# EAGLE design class-d-amp (EAGLE 5.10)
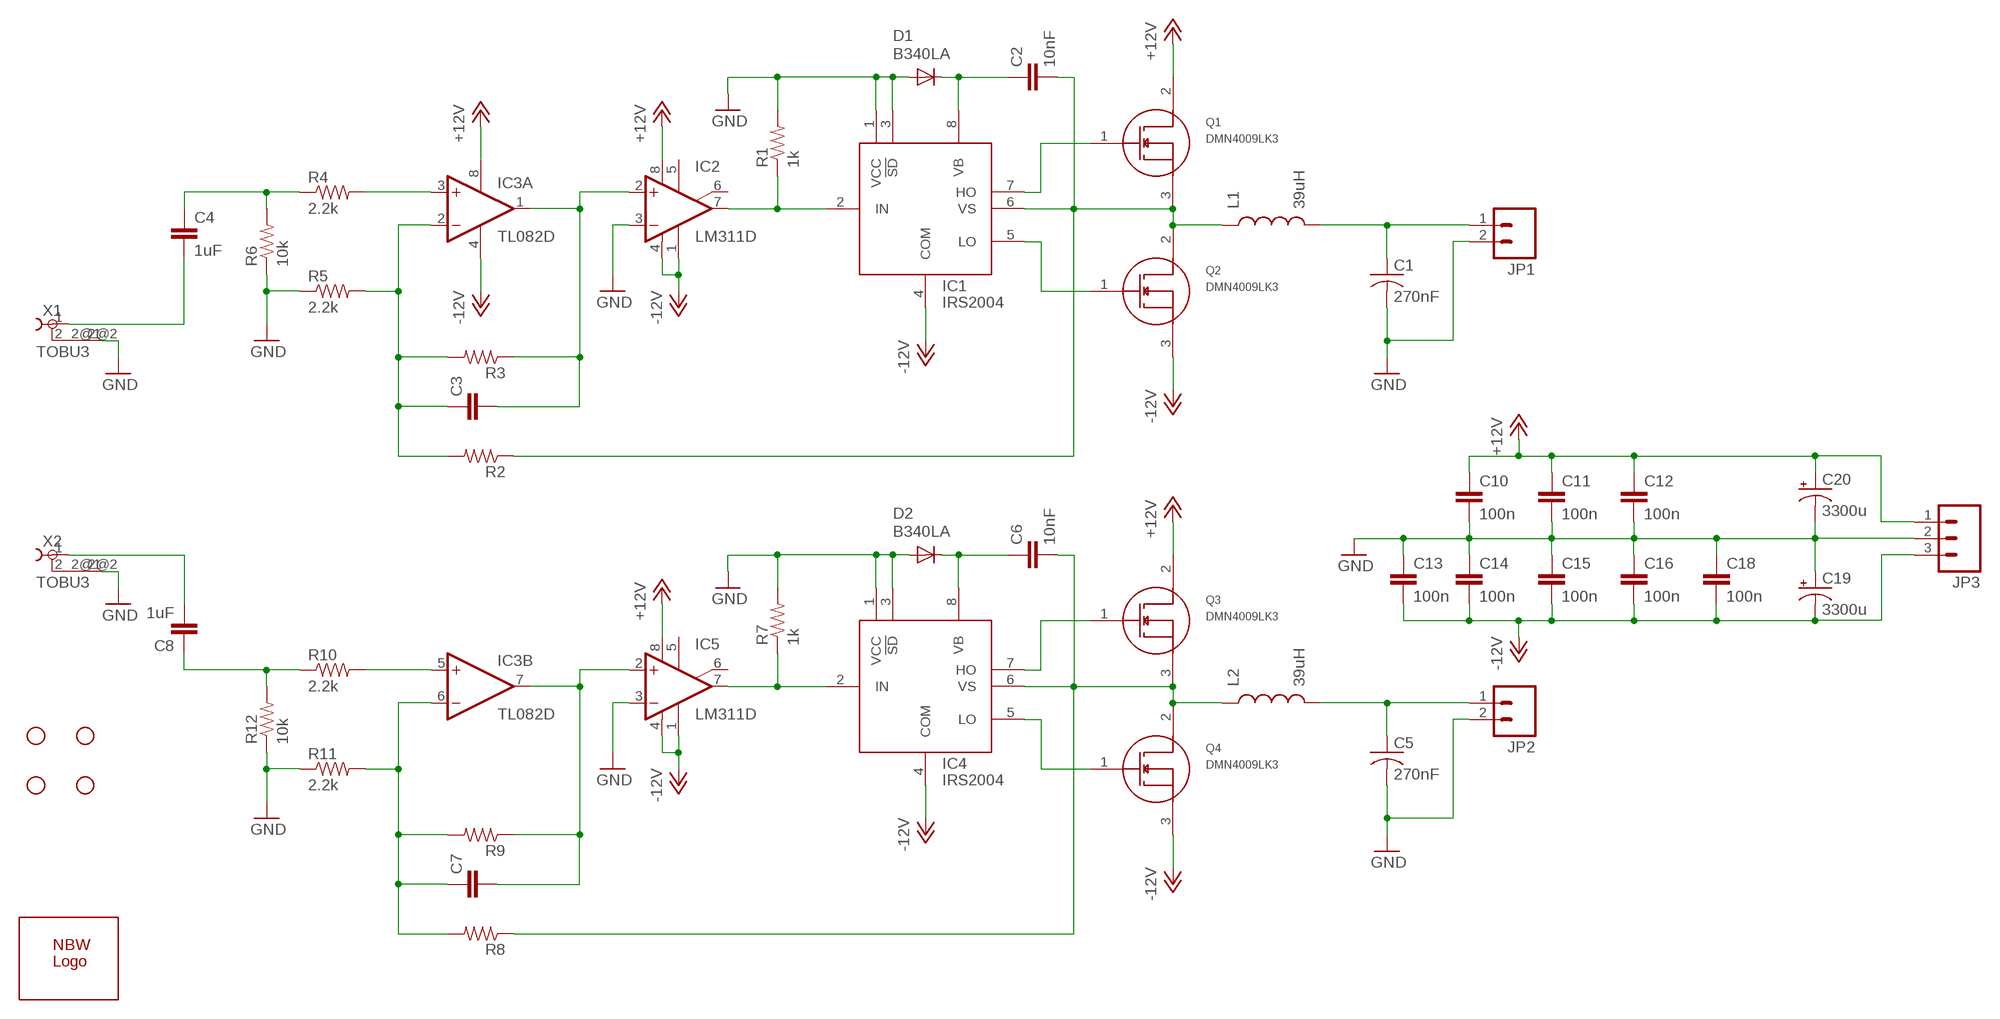
[diagram p0: schematic, sheet 1]

## Parts
C1  270nF  C-USC1210  [C1210]
C2  10nF  CAP0603  [0603]
C3  CAP0603  [0603]
C4  1uF  CAP0603  [0603]
C5  270nF  C-USC1210  [C1210]
C6  10nF  CAP0603  [0603]
C7  CAP0603  [0603]
C8  1uF  CAP0603  [0603]
C10  100n  CAP0603  [0603]
C11  100n  CAP0603  [0603]
C12  100n  CAP0603  [0603]
C13  100n  CAP0603  [0603]
C14  100n  CAP0603  [0603]
C15  100n  CAP0603  [0603]
C16  100n  CAP0603  [0603]
C18  100n  CAP0603  [0603]
C19  3300u  CPOL-USE7.5-16  [E7,5-16]
C20  3300u  CPOL-USE7.5-16  [E7,5-16]
D1  B340LA  DIODESMA  [SMA-DIODE]
D2  B340LA  DIODESMA  [SMA-DIODE]
IC1  IRS2004  IR2302  [SO-08]
IC2  LM311D  [SO08]
IC3  TL082D  [SO08]
IC4  IRS2004  IR2302  [SO-08]
IC5  LM311D  [SO08]
JP1  M02PTH  [1X02]
JP2  M02PTH  [1X02]
JP3  M03PTH  [1X03]
L1  39uH  INDUCTORPWR  [CDRH125]
L2  39uH  INDUCTORPWR  [CDRH125]
Q1  DMN4009LK3  [TO252-3L]
Q2  DMN4009LK3  [TO252-3L]
Q3  DMN4009LK3  [TO252-3L]
Q4  DMN4009LK3  [TO252-3L]
R1  1k  RESISTOR0603  [0603]
R2  RESISTOR0603  [0603]
R3  RESISTOR0603  [0603]
R4  2.2k  RESISTOR0603  [0603]
R5  2.2k  RESISTOR0603  [0603]
R6  10k  RESISTOR0603  [0603]
R7  1k  RESISTOR0603  [0603]
R8  RESISTOR0603  [0603]
R9  RESISTOR0603  [0603]
R10  2.2k  RESISTOR0603  [0603]
R11  2.2k  RESISTOR0603  [0603]
R12  10k  RESISTOR0603  [0603]
U$1  STAND-OFF  [STAND-OFF]
U$2  STAND-OFF  [STAND-OFF]
U$3  STAND-OFF  [STAND-OFF]
U$4  STAND-OFF  [STAND-OFF]
U$5  NBW_LOGOSMALL  [NBW_LOGO]
X1  TOBU3  [TOBU3]
X2  TOBU3  [TOBU3]

## Nets
+12V: C10.1 C11.1 C12.1 C20.+ IC2.8(V+) IC3.8(P:V+) IC5.8(V+) JP3.1 Q1.2 Q3.2
GND: C1.2 C5.2 C10.2 C11.2 C12.2 C13.1 C14.1 C15.1 C16.1 C18.1 C19.+ C20.- D1.A D2.A IC1.1(VCC) IC1.3(!SD) IC2.3(-IN) IC4.1(VCC) IC4.3(!SD) IC5.3(-IN) JP1.2 JP2.2 JP3.2 R1.2 R5.1 R6.1 R7.2 R11.1 R12.1 X1.2@2 X2.2@2
N$1: C1.1 JP1.1 L1.2
N$2: C3.2 IC2.2(+IN) IC3.1(A:OUT) R3.1
N$3: IC3.3(A:+IN) R4.2
N$4: IC1.7(HO) Q1.1
N$5: IC1.5(LO) Q2.1
N$6: IC1.2(IN) IC2.7(OUT) R1.1
N$7: C2.1 D1.C IC1.8(VB)
N$8: C3.1 IC3.2(A:-IN) R2.2 R3.2 R5.2
N$9: C2.2 IC1.6(VS) L1.1 Q1.3 Q2.2 R2.1
N$10: C4.1 R4.1 R6.2
N$11: C5.1 JP2.1 L2.2
N$12: IC4.7(HO) Q3.1
N$13: IC4.5(LO) Q4.1
N$14: C7.2 IC3.7(B:OUT) IC5.2(+IN) R9.1
N$15: IC4.2(IN) IC5.7(OUT) R7.1
N$16: C6.1 D2.C IC4.8(VB)
N$17: C7.1 IC3.6(B:-IN) R8.2 R9.2 R11.2
N$18: C6.2 IC4.6(VS) L2.1 Q3.3 Q4.2 R8.1
N$19: IC3.5(B:+IN) R10.2
N$20: C8.1 R10.1 R12.2
N$21: C4.2 X1.1
N$22: C8.2 X2.1
N$24: C13.2 C14.2 C15.2 C16.2 C18.2 C19.- IC1.4(COM) IC2.1(GND) IC2.4(V-) IC3.4(P:V-) IC4.4(COM) IC5.1(GND) IC5.4(V-) JP3.3 Q2.3 Q4.3 ; supply symbol labelled -12V
Unconnected: IC2.5(ON) IC2.6(ON/STR) IC5.5(ON) IC5.6(ON/STR) X1.2 X1.2@1 X2.2 X2.2@1

## Library data of the parts
C1 C5 = rcl:C-US: CAPACITOR, American symbol
C2-C4 C6-C8 C10-C16 C18 = SparkFun:CAP: Capacitor Standard 0603 ceramic capacitor, and 0.1" leaded capacitor.
C19 C20 = rcl:CPOL-US: POLARIZED CAPACITOR, American symbol
D1 D2 = SparkFun:DIODE: Diode These are standard reverse protection diodes and small signal diodes. SMA package can handle up to about 1A. SOD-323 can handle about 200mA. What the SOD-323 package when ordering, there are some mfgs out there that are 5-pin packages.
IC1 IC4 = Custom:IR2302
IC2 IC5 = linear:LM311: COMPARATOR
IC3 = linear:TL082: OP AMP
JP1 JP2 = SparkFun:M02: Header 2 Standard 2-pin 0.1" header. Use with straight break away headers (SKU : PRT-00116), right angle break away headers (PRT-00553), swiss pins (PRT-00743), machine pins (PRT-00117), and female headers (PRT-00115). Molex polarized connector foot print use with SKU : PRT-08233 with associated crimp pins and housings.
JP3 = SparkFun:M03: Header 3 Standard 3-pin 0.1" header. Use with straight break away headers (SKU : PRT-00116), right angle break away headers (PRT-00553), swiss pins (PRT-00743), machine pins (PRT-00117), and female headers (PRT-00115). Molex polarized connector foot print use with SKU : PRT-08232 with associated crimp pins and housings.
L1 L2 = SparkFun:INDUCTOR: Inductors Basic Inductor/Choke - 0603 and 1206. Footprints are not proven and vary greatly between part numbers.
Q1-Q4 = Custom:DMN4009LK3
R1-R12 = SparkFun:RESISTOR: Resistor Basic schematic elements and footprints for 0603, 1206, and PTH 1/10th watt (small) resistors.
U$1-U$4 = SparkFun:STAND-OFF: Stand Off This is the mechanical footprint for a #4 phillips button head screw. Use the keepout ring to avoid running the screw head into surrounding components. SKU : PRT-00447
U$5 = NBitWonder:NBW_LOGO
X1 X2 = con-hirschmann:TOBU3: Female Cinch CONNECTOR ( RCA Jack )

## Board
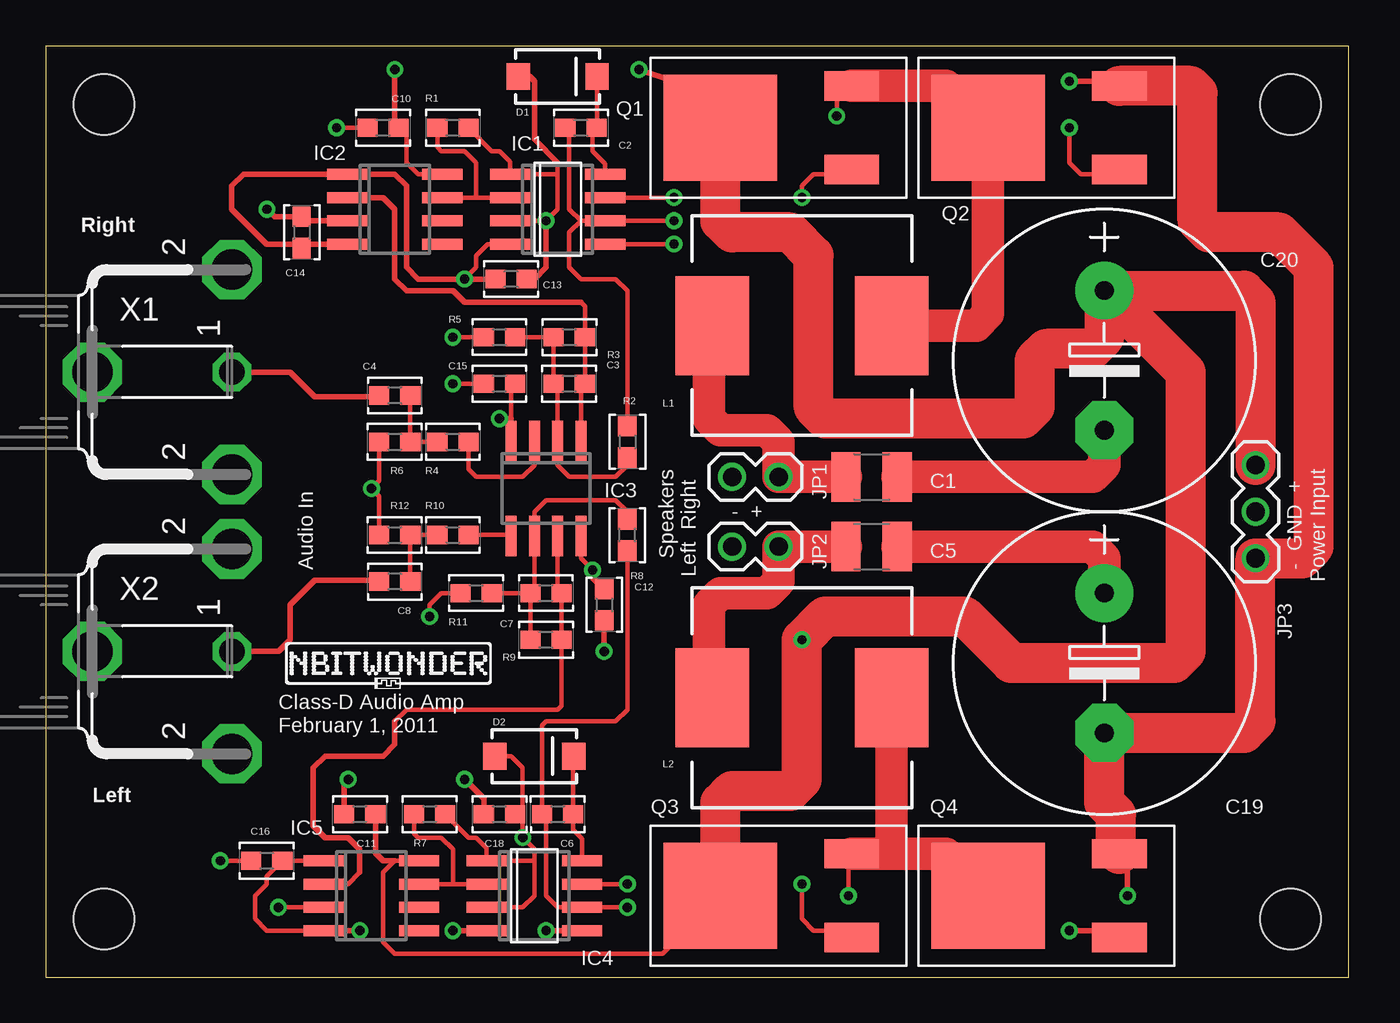
[diagram p1: board, top side]
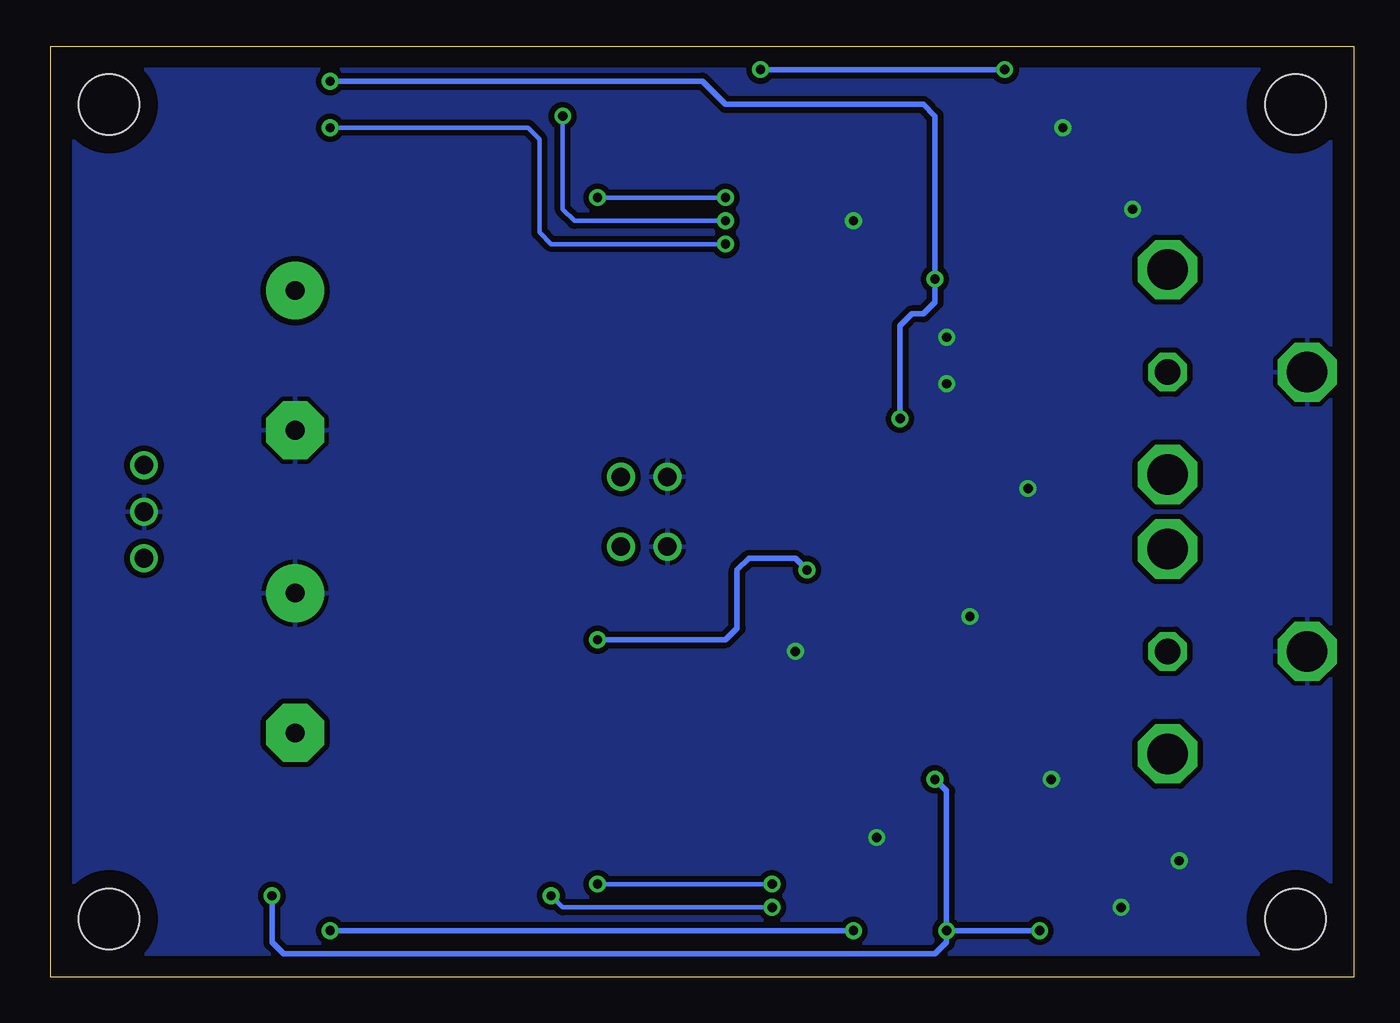
[diagram p2: board, bottom side, seen from below]

Size 71.12 x 50.8 mm. Coordinates in mm from the lower left corner, seen from the top.
Outline: 0,0 71.12,0 71.12,50.8 0,50.8 0,0
Copper layers (1*16): Top 0.035mm / dielectric 1.5mm / Bottom 0.035mm
Design rules "default *": minimum track width 10mil, minimum drill 24mil, track to track 8mil, track to pad 8mil, pad to pad 8mil, via to via 8mil, smd to smd 8mil, copper to edge 40mil, drill to drill 8mil, minimum pad ring 10mil, minimum via ring 8mil, stop-mask expansion 4mil, vias tented up to drill 20mil, thermal gap 10mil

### Footprints (pad centres in the part's own frame; a part is rotated, then mirrored left to right if it is on the bottom)
C1210 = smd 1.6 x 2.7: 1 -1.4,0; 2 1.4,0
0603 = smd 1.1 x 1: 1 -0.85,0; 2 0.85,0
E7,5-16 = drill 1.016 pad 3.15 round: + -3.81,0 | drill 1.016 pad 3.15 octagon: - 3.81,0
SMA-DIODE = smd 1.27 x 1.47: A -2.15,0; C 2.15,0
SO-08 = smd 0.6 x 2.2: 1 -1.905,-2.6; 2 -0.635,-2.6; 3 0.635,-2.6; 4 1.905,-2.6; 5 1.905,2.6; 6 0.635,2.6; 7 -0.635,2.6; 8 -1.905,2.6
SO08 = smd 0.6 x 2.2: 1 -1.905,-2.6; 2 -0.635,-2.6; 3 0.635,-2.6; 4 1.905,-2.6; 5 1.905,2.6; 6 0.635,2.6; 7 -0.635,2.6; 8 -1.905,2.6
1X02 = drill 1.016 round: 1 0,0; 2 2.54,0
1X03 = drill 1.016 round: 1 0,0; 2 2.54,0; 3 5.08,0
CDRH125 = smd 5.4 x 4: 1 0,4.9; 2 0,-4.9
TO252-3L = smd 2.997 x 1.6: 1 7.163,-2.286; 3 7.163,2.286 | smd 6.198 x 5.791: 2 0,0
STAND-OFF = hole 3.302: 0,0
TOBU3 = drill 1.397 octagon: 1 0,-2.54 | drill 2.21 octagon: 2 5.588,-2.54; 2@1 -5.588,-2.54; 2@2 0,5.08

### Placement (x,y rotation side)
C1  45.09,27.3 0 top
C2  29.21,46.35 180 top
C3  28.57,32.38 0 top
C4  19.05,31.75 180 top
C5  45.09,23.5 0 top
C6  27.94,8.89 180 top
C7  27.3,20.95 0 top
C8  19.05,21.59 180 top
C10  18.41,46.35 180 top
C11  17.14,8.89 180 top
C12  30.48,20.32 270 top
C13  25.4,38.1 180 top
C14  13.97,40.64 270 top
C15  24.77,32.38 0 top
C16  12.06,6.35 0 top
C18  24.77,8.89 180 top
C19  57.78,17.14 270 top
C20  57.78,33.66 270 top
D1  27.94,49.15 0 top
D2  26.67,12.06 0 top
IC1  27.94,41.91 270 top
IC2  19.05,41.91 270 top
IC3  27.3,26.67 180 top
IC4  26.67,4.45 270 top
IC5  17.78,4.45 270 top
JP1  40.01,27.3 180 top
JP2  40.01,23.5 180 top
JP3  66.04,27.94 270 top
L1  41.27,35.56 270 top
L2  41.27,15.24 270 top
Q1  36.83,46.35 0 top
Q2  51.44,46.35 0 top
Q3  36.83,4.45 0 top
Q4  51.44,4.45 0 top
R1  22.23,46.35 0 top
R2  31.75,29.21 270 top
R3  28.57,34.92 180 top
R4  22.23,29.21 0 top
R5  24.77,34.92 0 top
R6  19.05,29.21 0 top
R7  20.95,8.89 0 top
R8  31.75,24.13 90 top
R9  27.3,18.41 180 top
R10  22.23,24.13 0 top
R11  23.5,20.95 0 top
R12  19.05,24.13 0 top
U$1  3.17,3.17 0 top
U$2  3.17,47.62 0 top
U$3  67.94,3.17 0 top
U$4  67.94,47.62 0 top
U$5  12.7,15.24 0 top
X1  7.62,33.02 90 top
X2  7.62,17.78 90 top

### Tracks (layer width: path | path; a pad name or v marks a point on that pad's centre or on a via)
+12V  (via drill 0.51)
  Top 0.254: IC5.8 19.05,6.35 18.41,5.71 18.41,1.91 19.05,1.27 33.66,1.27 Q3.2 | IC2.8 20.32,43.81 19.68,44.45 19.68,45.94 C10.1 | IC3.8 29.21,22.86 v29.84,22.23
  Top 0.305: Q1.2 34.29,48.9 v32.38,49.53 | v19.05,49.53 19.05,46.57 C10.1 | C11.1 18,6.77 18.41,6.35 19.05,6.35 | v29.84,22.23 29.84,21.8 C12.1
  Top 2.184: JP3.1 66.04,36.83 65.41,37.47 C20.+ | C20.+ 57.78,34.92 57.15,34.29 54.61,34.29 53.98,33.66 53.98,31.11 53.34,30.48 42.55,30.48 41.91,31.11 41.91,39.37 40.64,40.64 37.47,40.64 36.83,41.27 Q1.2 | Q3.2 36.83,9.53 37.47,10.16 40.64,10.16 41.27,10.79 v41.27,18.41 42.55,19.68 50.16,19.68 52.7,17.14 61.59,17.14 62.23,17.78 62.23,33.02 C20.+
  Bottom 0.305: v32.38,49.53 v19.05,49.53 | v41.27,18.41 34.29,18.41 33.66,19.05 33.66,22.23 33.02,22.86 30.48,22.86 v29.84,22.23
GND  (via drill 0.51)
  Top 0.254: IC4.3 26.04,3.81 26.67,4.45 26.67,6.35 | 26.67,6.35 26.67,6.99 v26.04,7.62 26.04,8.47 C18.1 26.04,9.31 26.04,11.43 25.4,12.06 D2.A | 26.67,6.35 IC4.1 24.07,7.04 23.5,7.62 23.07,7.62 R7.2 | IC1.3 v27.3,41.27 27.94,41.91 27.94,43.81 | 27.94,43.81 27.94,44.45 | 27.94,43.81 IC1.1 25.34,44.51 24.77,45.09 24.34,45.09 R1.2 | R6.1 18.2,27.09 v17.78,26.67 18.2,26.25 R12.1 | IC5.3 v12.7,3.81 | R11.1 21.59,20.95 20.95,20.32 v20.95,19.68 | C10.2 v15.88,46.35 | v22.23,34.92 R5.1 | v22.23,32.38 C15.1 | v9.53,6.35 C16.1
  Top 0.305: C12.2 v30.48,17.78 | C11.2 16.3,10.58 v16.51,10.79 | D1.A 26.41,49.15 26.67,48.9 26.67,45.72 27.94,44.45 | C13.1 26.67,38.1 27.3,38.73 v27.3,41.27 | IC2.3 14.19,41.27 C14.1 12.48,41.49 v12.06,41.91
  Top 1.778: C1.2 57.15,27.3 57.78,27.94 C20.- | C5.2 57.15,23.5 57.78,22.86 C19.+
  pour Bottom (isolate 0.305): 1.27,1.27 69.85,1.27 69.85,49.53 1.27,49.53
N$1
  Top 1.778: L1.2 36.2,35.38 36.2,30.48 36.83,29.84 39.37,29.84 40.01,29.21 JP1.1 C1.1
N$2
  Top 0.254: IC3.1 29.21,32.17 C3.2 R3.1 29.43,36.62 29.21,36.83
  Top 0.305: 29.21,36.83 22.86,36.83 22.23,37.47 19.68,37.47 19.05,38.1 19.05,41.91 18.41,42.55 IC2.2
N$3
  Top 0.254: R4.2 23.07,27.73 23.5,27.3 26.04,27.3 26.67,27.94 IC3.3
N$4  (via drill 0.51)
  Top 0.254: IC1.7 v34.29,42.55 | v41.27,42.55 41.27,43.18 41.91,43.81 43.74,43.81 Q1.1
  Bottom 0.254: v34.29,42.55 v41.27,42.55
N$5  (via drill 0.51)
  Top 0.254: IC1.5 v34.29,40.01 | v55.88,46.35 55.88,44.45 56.52,43.81 58.34,43.81 Q2.1
  Bottom 0.254: v34.29,40.01 43.81,40.01 44.45,40.64 44.45,45.72 45.09,46.35 v55.88,46.35
N$6
  Top 0.254: IC2.7 23.5,42.55 | 23.5,42.55 IC1.2 | R1.1 21.38,45.3 21.59,45.09 22.86,45.09 23.5,44.45 23.5,42.55
N$7
  Top 0.254: D1.C 30.09,46.38 C2.1 29.84,46.14 29.84,45.09 30.54,44.39 IC1.8
N$8
  Top 0.254: R2.2 31.75,27.94 31.11,27.3 28.57,27.3 27.94,27.94 IC3.2 27.94,32.17 C3.1 R3.2 R5.2
N$9  (via drill 0.51)
  Top 0.254: v34.29,41.27 IC1.6 29.21,41.27 | v43.18,46.99 43.18,47.83 Q1.3 | 29.21,41.27 28.57,41.91 28.57,46.14 C2.2 | R2.1 31.75,37.47 31.11,38.1 29.21,38.1 28.57,38.73 28.57,40.64 29.21,41.27
  Top 1.778: Q1.3 49.15,48.64 Q2.2 51.44,36.2 50.8,35.56 L1.1
  Bottom 0.254: v34.29,41.27 42.55,41.27 43.18,41.91 v43.18,46.99
N$10
  Top 0.254: C4.1 R6.2 R4.1
N$11
  Top 1.778: L2.2 36.2,15.42 36.2,20.32 36.83,20.95 39.37,20.95 40.01,21.59 JP2.1 C5.1
N$12  (via drill 0.51)
  Top 0.254: IC4.7 v31.75,5.08 | v41.27,5.08 41.27,3.17 41.91,2.54 43.61,2.54 Q3.1
  Bottom 0.254: v31.75,5.08 v41.27,5.08
N$13  (via drill 0.51)
  Top 0.305: v27.3,2.54 IC4.5 | v55.88,2.54 58.22,2.54 Q4.1
  Bottom 0.305: v27.3,2.54 v55.88,2.54
N$14
  Top 0.254: IC3.7 27.94,21.17 C7.2 R9.1 28.16,14.82 27.94,14.61 19.68,14.61 19.05,13.97 | 17.14,5.71 16.51,5.08 IC5.2
  Top 0.305: 17.14,5.71 17.14,6.99 16.51,7.62 15.24,7.62 14.61,8.26 14.61,11.43 15.24,12.06 18.41,12.06 19.05,12.7 19.05,13.97
N$15
  Top 0.254: 22.23,5.08 IC5.7 | 22.23,5.08 IC4.2 | R7.1 20.11,7.83 20.32,7.62 21.59,7.62 22.23,6.99 22.23,5.08
N$16
  Top 0.254: IC4.8 29.27,7.56 28.79,8.04 C6.1 28.79,12.04 D2.C
N$17
  Top 0.254: C7.1 26.67,21.17 IC3.6 26.67,25.4 27.3,26.04 31.11,26.04 31.75,25.4 R8.2 | C7.1 R9.2 | R11.2 C7.1
N$18  (via drill 0.51)
  Top 0.254: v31.75,3.81 IC4.6 27.94,3.81 27.3,4.45 27.3,8.68 C6.2 27.09,13.76 27.3,13.97 31.11,13.97 31.75,14.61 R8.1 | v43.81,4.45 43.81,6.55 Q3.3
  Top 1.778: Q3.3 46.35,6.73 | 46.35,6.73 49.15,6.73 Q4.2 | L2.1 46.17,6.91 46.35,6.73
  Bottom 0.254: v31.75,3.81 43.18,3.81 v43.81,4.45
N$19
  Top 0.254: R10.2 25.34,24.13 IC3.5
N$20
  Top 0.254: C8.1 R12.2 R10.1
N$21
  Top 0.254: 18.12,31.67 C4.2
  Top 0.305: 18.12,31.67 14.69,31.67 13.34,33.02 X1.1
N$22
  Top 0.254: C8.2 18.12,21.67
  Top 0.305: 18.12,21.67 14.69,21.67 13.34,20.32 13.34,18.41 12.7,17.78 X2.1
N$24  (via drill 0.51)
  Top 0.254: IC1.4 24.13,40.01 23.5,39.37 23.5,38.73 v22.86,38.1 | IC3.4 25.4,30.48 25.4,32.17 C15.2 | IC5.1 C16.2 12.06,5.5 12.06,5.08 11.43,4.45 11.43,3.17 12.06,2.54 IC5.4
  Top 0.305: v22.23,2.54 IC4.4 | v59.05,4.45 59.05,6.27 Q4.3 | IC5.4 v17.14,2.54 | C13.2 v22.86,38.1 20.32,38.1 19.68,38.73 19.68,43.18 19.05,43.81 IC2.1 10.79,43.81 10.16,43.18 10.16,41.91 12.06,40.01 IC2.4 14.19,40.01 C14.2 | v24.77,30.48 25.4,30.48 | C18.2 23.91,9.74 v22.86,10.79 | v55.88,48.9 58.42,48.9 58.6,48.72 Q2.3
  Top 2.184: Q4.3 58.42,6.91 58.42,8.89 57.78,9.53 C19.- 65.41,13.34 66.04,13.97 JP3.3 68.58,22.86 69.22,23.5 69.22,38.73 67.31,40.64 63.5,40.64 62.87,41.27 62.87,48.26 62.48,48.64 Q2.3
  Bottom 0.305: v55.88,48.9 35.56,48.9 34.29,47.62 23.5,47.62 22.86,46.99 v22.86,38.1 22.86,36.83 23.5,36.2 24.13,36.2 24.77,35.56 v24.77,30.48 | v22.23,2.54 22.23,1.91 22.86,1.27 58.42,1.27 59.05,1.91 v59.05,4.45 | v17.14,2.54 v22.23,2.54 | v22.23,2.54 22.23,10.16 v22.86,10.79

### Text on the board
tPlace: Right | - + | Speakers | Audio In | Left Right | - GND + | Power Input | Class-D Audio Amp | February 1, 2011 | Left